# Altium schematic sheet DC_EXT.SchDoc
size A4
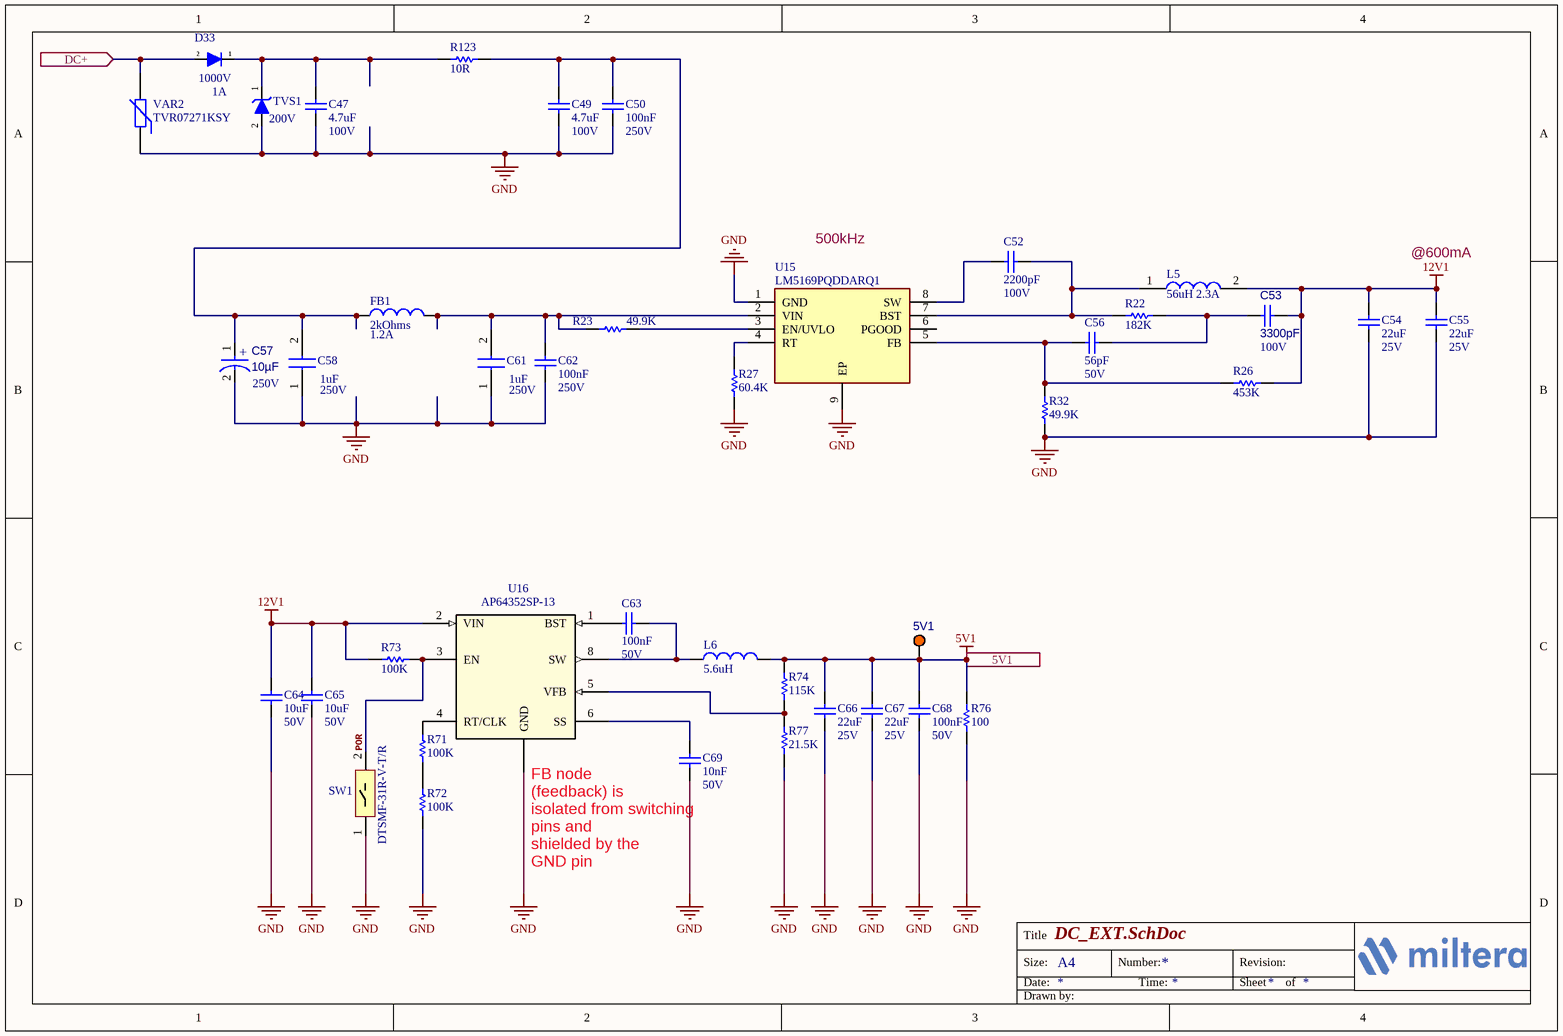
[diagram p0: DC_EXT.SchDoc]

## Parts
5V1  L-KLS8-TP5003  [TEST_POINT_ORANGE]  (value not drawn)
C47  value 4.7uF  Voltage: 100V  [CAP_1206]  (hidden comment: GRM31CC72A475KE11L)
C49  value 4.7uF  Voltage: 100V  [CAP_1206]  (hidden comment: GRM31CC72A475KE11L)
C50  value 100nF  Voltage: 250V  [CAP_1206]  (hidden comment: CL31B104KEHSFNE)
C52  value 2200pF  Voltage: 100V  [CAP_0603]  (hidden comment: CL10B222KC8NNNC)
C53  value 3300pF  Voltage: 100V  [cap_0805]  (hidden comment: MCFA05KTB101332A)
C54  value 22uF  Voltage: 25V  [CAP_0805]  (hidden comment: CL21A226MAYNNNE)
C55  value 22uF  Voltage: 25V  [CAP_0805]  (hidden comment: CL21A226MAYNNNE)
C56  value 56pF  Voltage: 50V  [CAP_0603]  (hidden comment: CL10C560JB8NNNC)
C57  value 10µF  Voltage: 250V  [ELEC_CAP_SMD_8x10.5]  (hidden comment: ULR2E100MNL1GS)
C58  value 1uF  Voltage: 250V  [CAPC4632X280N]  (hidden comment: CHV1812N250105KXT)
C61  value 1uF  Voltage: 250V  [CAPC4632X280N]  (hidden comment: CHV1812N250105KXT)
C62  value 100nF  Voltage: 250V  [CAP_1206]  (hidden comment: CL31B104KEHSFNE)
C63  value 100nF  Voltage: 50V  [CAP_0603]  (hidden comment: CAP)
C64  value 10uF  Voltage: 50V  [CAP_1206]  (hidden comment: CAP)
C65  value 10uF  Voltage: 50V  [CAP_1206]  (hidden comment: CAP)
C66  value 22uF  Voltage: 25V  [CAP_0805]  (hidden comment: CAP)
C67  value 22uF  Voltage: 25V  [CAP_0805]  (hidden comment: CAP)
C68  value 100nF  Voltage: 50V  [CAP_0603]  (hidden comment: CAP)
C69  value 10nF  Voltage: 50V  [CAP_0603]  (hidden comment: CL10B103KB8NNNC)
D33  Current: 1A  Voltage: 1000V  [SMA]  (hidden comment: Diode-SMA)
FB1  value 2kOhms  Current: 1.2A  [BEADC3225X280N]  (hidden comment: FBMH3225HM202NT)
L5  value 56uH 2.3A  [INDPM120120X800N]  (hidden comment: SPD127R-563M)
L6  value 5.6uH  [BOBIN3]  (hidden comment: IND)
R22  value 182K  [RES_0603]  (hidden comment: 0603SAF1823T5E)
R23  value 49.9K  [RES_0603]  (hidden comment: 0603SAF4992T5E)
R26  value 453K  [RES_0603]  (hidden comment: 0603SAF4533T5E)
R27  value 60.4K  [RES_0603]  (hidden comment: 0603SAF6042T5E)
R32  value 49.9K  [RES_0603]  (hidden comment: 0603SAF4992T5E)
R71  value 100K  [RES_0603]  (hidden comment: RES)
R72  value 100K  [RES_0603]  (hidden comment: RES)
R73  value 100K  [RES_0603]  (hidden comment: RES)
R74  value 115K  [RES_0603]  (hidden comment: 0603SAF1153T5E)
R76  value 100  [RES_1206]  (hidden comment: RES)
R77  value 21.5K  [RES_0603]  (hidden comment: 0603SAF2152T5E)
R123  10R  [VAR_10mm]
SW1  DTSMF-31R-V-T/R  [tact_switch]
TVS1  value 200V  [SMB]  (hidden comment: P6SMBJ200CA_R2_00001)
U15  LM5169PQDDARQ1  [SOIC127P600X170-9N]
U16  Manufacturer Part Number: AP64352SP-13  [SO-8EP]  (hidden comment: AP64352)
VAR2  TVR07271KSY  [VAR_7mm]

## Ports
5V1 (in), DC+ (in)

## Nets
5V1: 5V1.1 C66.1 C67.1 C68.2 L6.2 R74.1 R76.1 ; port 5V1
12V1: C53.2 C54.1 C55.1 C64.1 C65.1 L5.2 R26.1 R73.2 U16.2(VIN)
GND: C47.2 C49.2 C50.2 C54.2 C55.2 C57.2 C58.1 C61.1 C62.2 C64.2 C65.2 C66.2 C67.2 C68.1 C69.2 R27.1 R32.1 R72.1 R76.2 R77.2 SW1.1 TVS1.2(A) U15.1(GND) U15.9(EP) U16.7,9(GND) VAR2.1
DC+: D33.2 VAR2.2 ; port DC+
POR: R73.1 SW1.2 U16.3(EN)
NetC47_1: C47.1 D33.1 R123.2 TVS1.1(K)
NetC49_1: C49.1 C50.1 C57.1 C58.2 FB1.1 R123.1
NetC52_1: C52.1 U15.8(SW)
NetC52_2: C52.2 L5.1 R22.2 U15.7(BST)
NetC53_1: C53.1 C56.1 R22.1
NetC56_2: C56.2 R26.2 R32.2 U15.5(FB)
NetC61_2: C61.2 C62.1 FB1.2 R23.2 U15.2(VIN)
NetC63_1: C63.1 U16.1(BST)
NetC63_2: C63.2 L6.1 U16.8(SW)
NetC69_1: C69.1 U16.6(SS)
NetR23_1: R23.1 U15.3(EN/UVLO)
NetR27_2: R27.2 U15.4(RT)
NetR71_1: R71.1 R72.2
NetR71_2: R71.2 U16.4(RT/CLK)
NetR74_2: R74.2 R77.1 U16.5(VFB)

Not connected (* = marked no-connect by the designer): U15 6(PGOOD)

## Notes on the sheet
- 500kHz
- @600mA
- (near C69) FB node
  (feedback) is
  isolated from switching pins and
  shielded by the
  GND pin
- Title
- Size:
- Date:
- A4
- Number:
- Time:
- Revision:
- Sheet
- of
- Drawn by:
- (in symbol 865060353009) +

## Library data of the parts
5V1 = 5003: PC TEST POINT MINIATURE ORANGE 2.54MMX4.60MM; Manufacturer: KLS ELECTRONIC; Package: 1mm THT Pad; Manufacturer Part Number: L-KLS8-TP5003
C47 C49 = C01772: CAP CER 4.7UF 100V X7S 1206; Manufacturer: Murata Electronics; Manufacturer Part Number: GRM31CC72A475KE11L
C50 C62 = C01772: CAP CER 0.1UF 250V X7R 1206; Manufacturer: Samsung; Manufacturer Part Number: CL31B104KEHSFNE
C52 = C01783: MLCC (1608) 0603 2.2nF 100VDC ±10% X7R; Manufacturer: SAMSUNG; Manufacturer Part Number: CL10B222KC8NNNC
C53 = C2012X5R1V156M125AC: MLCC (2012) 0805 3.3nF 100VDC ±10% X7R AUTOMOTIVE; Manufacturer: VIKING; Package: 0805 (2012 Metric); Manufacturer Part Number: MCFA05KTB101332A
C54 C55 = C01760: CAP CER 22UF 25V X5R 0805; Manufacturer: Samsung; Manufacturer Part Number: CL21A226MAYNNNE
C56 = C01783: MLCC (1608) 0603 56pF 50VDC ±5% C0G (NP0); Manufacturer: SAMSUNG; Manufacturer Part Number: CL10C560JB8NNNC
C57 = 865060353009: CAP ALUM 10UF 20% 250V SMD; Manufacturer: Nichicon; Package: SMD 8x10.5; Manufacturer Part Number: ULR2E100MNL1GS
C58 C61 = 1812VC105KAT2A: MLCC (4532) 1812  1uF 250VDC ±10% X7R; Manufacturer: Cal-Chip Electronics; Manufacturer Part Number: CHV1812N250105KXT
C63 C68 = C01763: CAP CER 100nF 50VDC %10 X7R SMD; Manufacturer: Samsung; Manufacturer Part Number: CL10B104KB8NNNL
C64 C65 = C01772: MLCC (3216) 1206 10uF 50VDC ±10% X5R; Manufacturer: Samsung; Manufacturer Part Number: CL31A106KBHNNNE
C66 C67 = C01760: CAP CER 22UF 25VDC %20 X5R SMD; Manufacturer: Samsung; Manufacturer Part Number: CL21A226MAQNNNE
C69 = C01763: MLCC (1608) 0603 10nF 50VDC ±10% X7R; Manufacturer: SAMSUNG; Manufacturer Part Number: CL10B103KB8NNNC
D33 = DIO00042: DIODE U.FAST RECOVERY Single 1A 1000V DO-214AC SMA; Manufacturer Part Number: US1M-E3/61T; Manufacturer: Vishay
FB1 = IND0000023: FERRITE BEAD 2 KOHM 1210 1LN; Manufacturer: Taiyo Yuden; Manufacturer Part Number: FBMH3225HM202NT
L5 = SPD127R-563M: FIXED IND 56UH 2.3A 120 MOHM SMD; Manufacturer: API Delevan; Manufacturer Part Number: SPD127R-563M
L6 = IND0000023: INDUCTOR POWER 5.6UH 6.6X6.2X5MM SMD; Manufacturer: Core Master; Manufacturer Part Number: SRI0605B-5R6M
R22 = R03011: RES.(1608) 0603 182K Ohms 1% 1/10W-S 100PPM; Manufacturer: ROYALOHM; Manufacturer Part Number: 0603SAF1823T5E
R23 R32 = R03011: RES.(1608) 0603 49.9K Ohms 1% 1/10W-S 100PPM; Manufacturer: ROYALOHM; Manufacturer Part Number: 0603SAF4992T5E
R26 = R03011: RES.(1608) 0603 453K Ohms 1% 1/10W-S 100PPM; Manufacturer: ROYALOHM; Manufacturer Part Number: 0603SAF4533T5E
R27 = R03011: RES.(1608) 0603 60.4K Ohms 1% 1/10W-S 100PPM; Manufacturer: ROYALOHM; Manufacturer Part Number: 0603SAF6042T5E
R71-R73 = R03011: RES 0603 100K Ohms 1% 1/10W-S 100PPM; Manufacturer: ROYALOHM; Manufacturer Part Number: 0603SAF1003T5E
R74 = R03011: RES.(1608) 0603 115K Ohms 1% 1/10W-S 100PPM; Manufacturer: ROYALOHM; Manufacturer Part Number: 0603SAF1153T5E
R76 = R00977: RES SMD 100 OHM 1% 1/4W 1206; Manufacturer: Yageo; Manufacturer Part Number: RC1206FR-07100RL
R77 = R03011: RES.(1608) 0603 21.5K Ohms 1% 1/10W-S 100PPM; Manufacturer: ROYALOHM; Manufacturer Part Number: 0603SAF2152T5E
R123 = FUSE6: INRUSH CURRENT LIMITERS 10R 10MM 3A; Manufacturer Part Number: SCK10103LIY501; Manufacturer: THINKING
SW1 = Tact_Switch: SWITCH TACT 6.00x3.50 4.30mm 260gF SMT V/T; Manufacturer: DIPTRONICS; Manufacturer Part Number: DTSMF-31R-V-T/R
TVS1 = DIO00041: DIODE TVS 600W 200V DO214AA (SMB) SMT; Manufacturer: PANJIT; Manufacturer Part Number: P6SMBJ200CA_R2_00001
U15 = LM5169PQDDARQ1: IC REG BCK FLYBACK ADJ 14HTSSOP; Manufacturer: Texas Instruments; Manufacturer Part Number: LM5169PQDDARQ1
U16 = P000129: Buck Switching Regulator IC Positive Adjustable 0.8V 1 Output 3.5A 8-SOIC (0.154", 3.90mm Width) Exposed Pad; Manufacturer: Diodes Incorporated
VAR2 = V000004: VARISTOR DISC 7MM 270V 1.2KA 175VAC 225VDC THT; Manufacturer: THINKING; Value: 47V; Manufacturer Part Number: TVR07271KSY